# Altium schematic sheet MAX96724_EVB_revB.SchDoc
size C; SheetNumber: 1; SheetTotal: 4
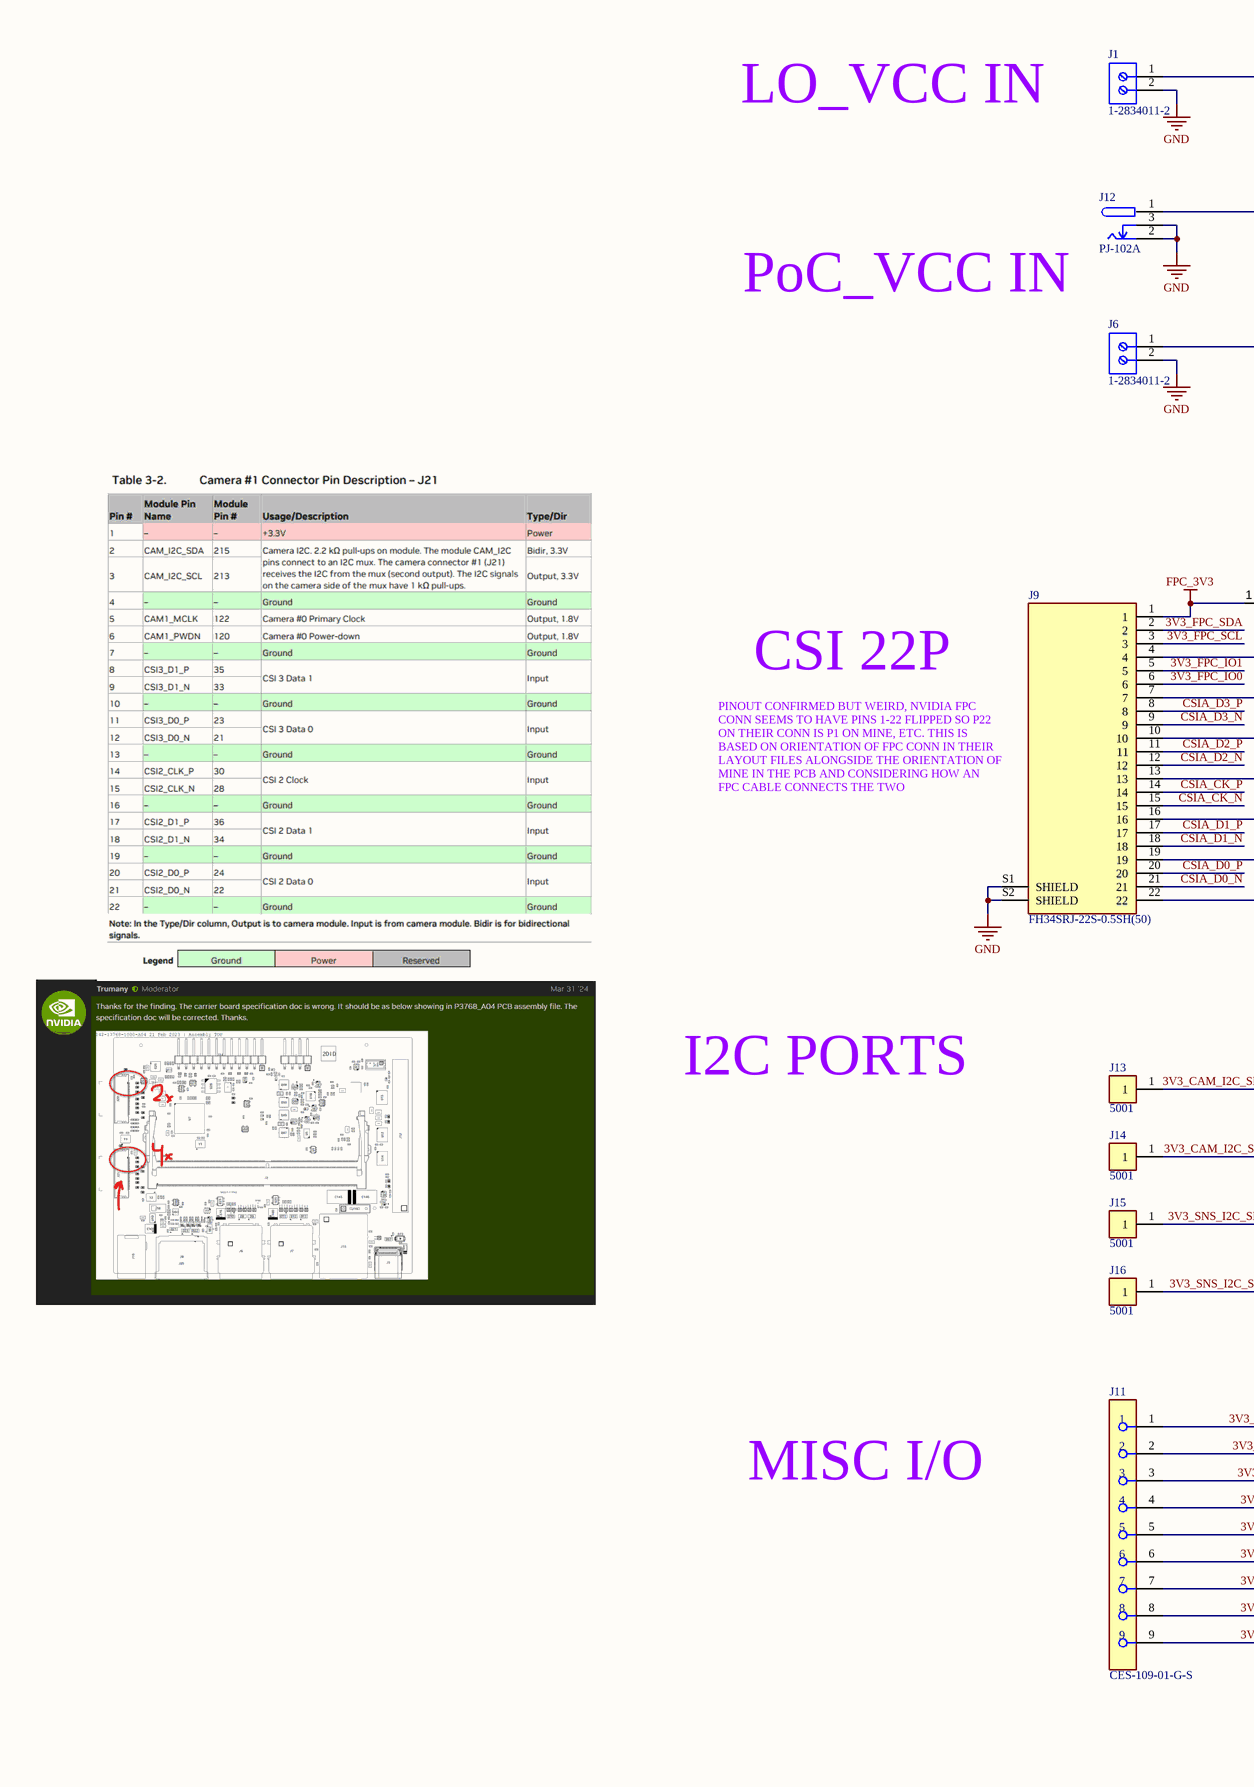
[diagram p0: MAX96724_EVB_revB.SchDoc, left]
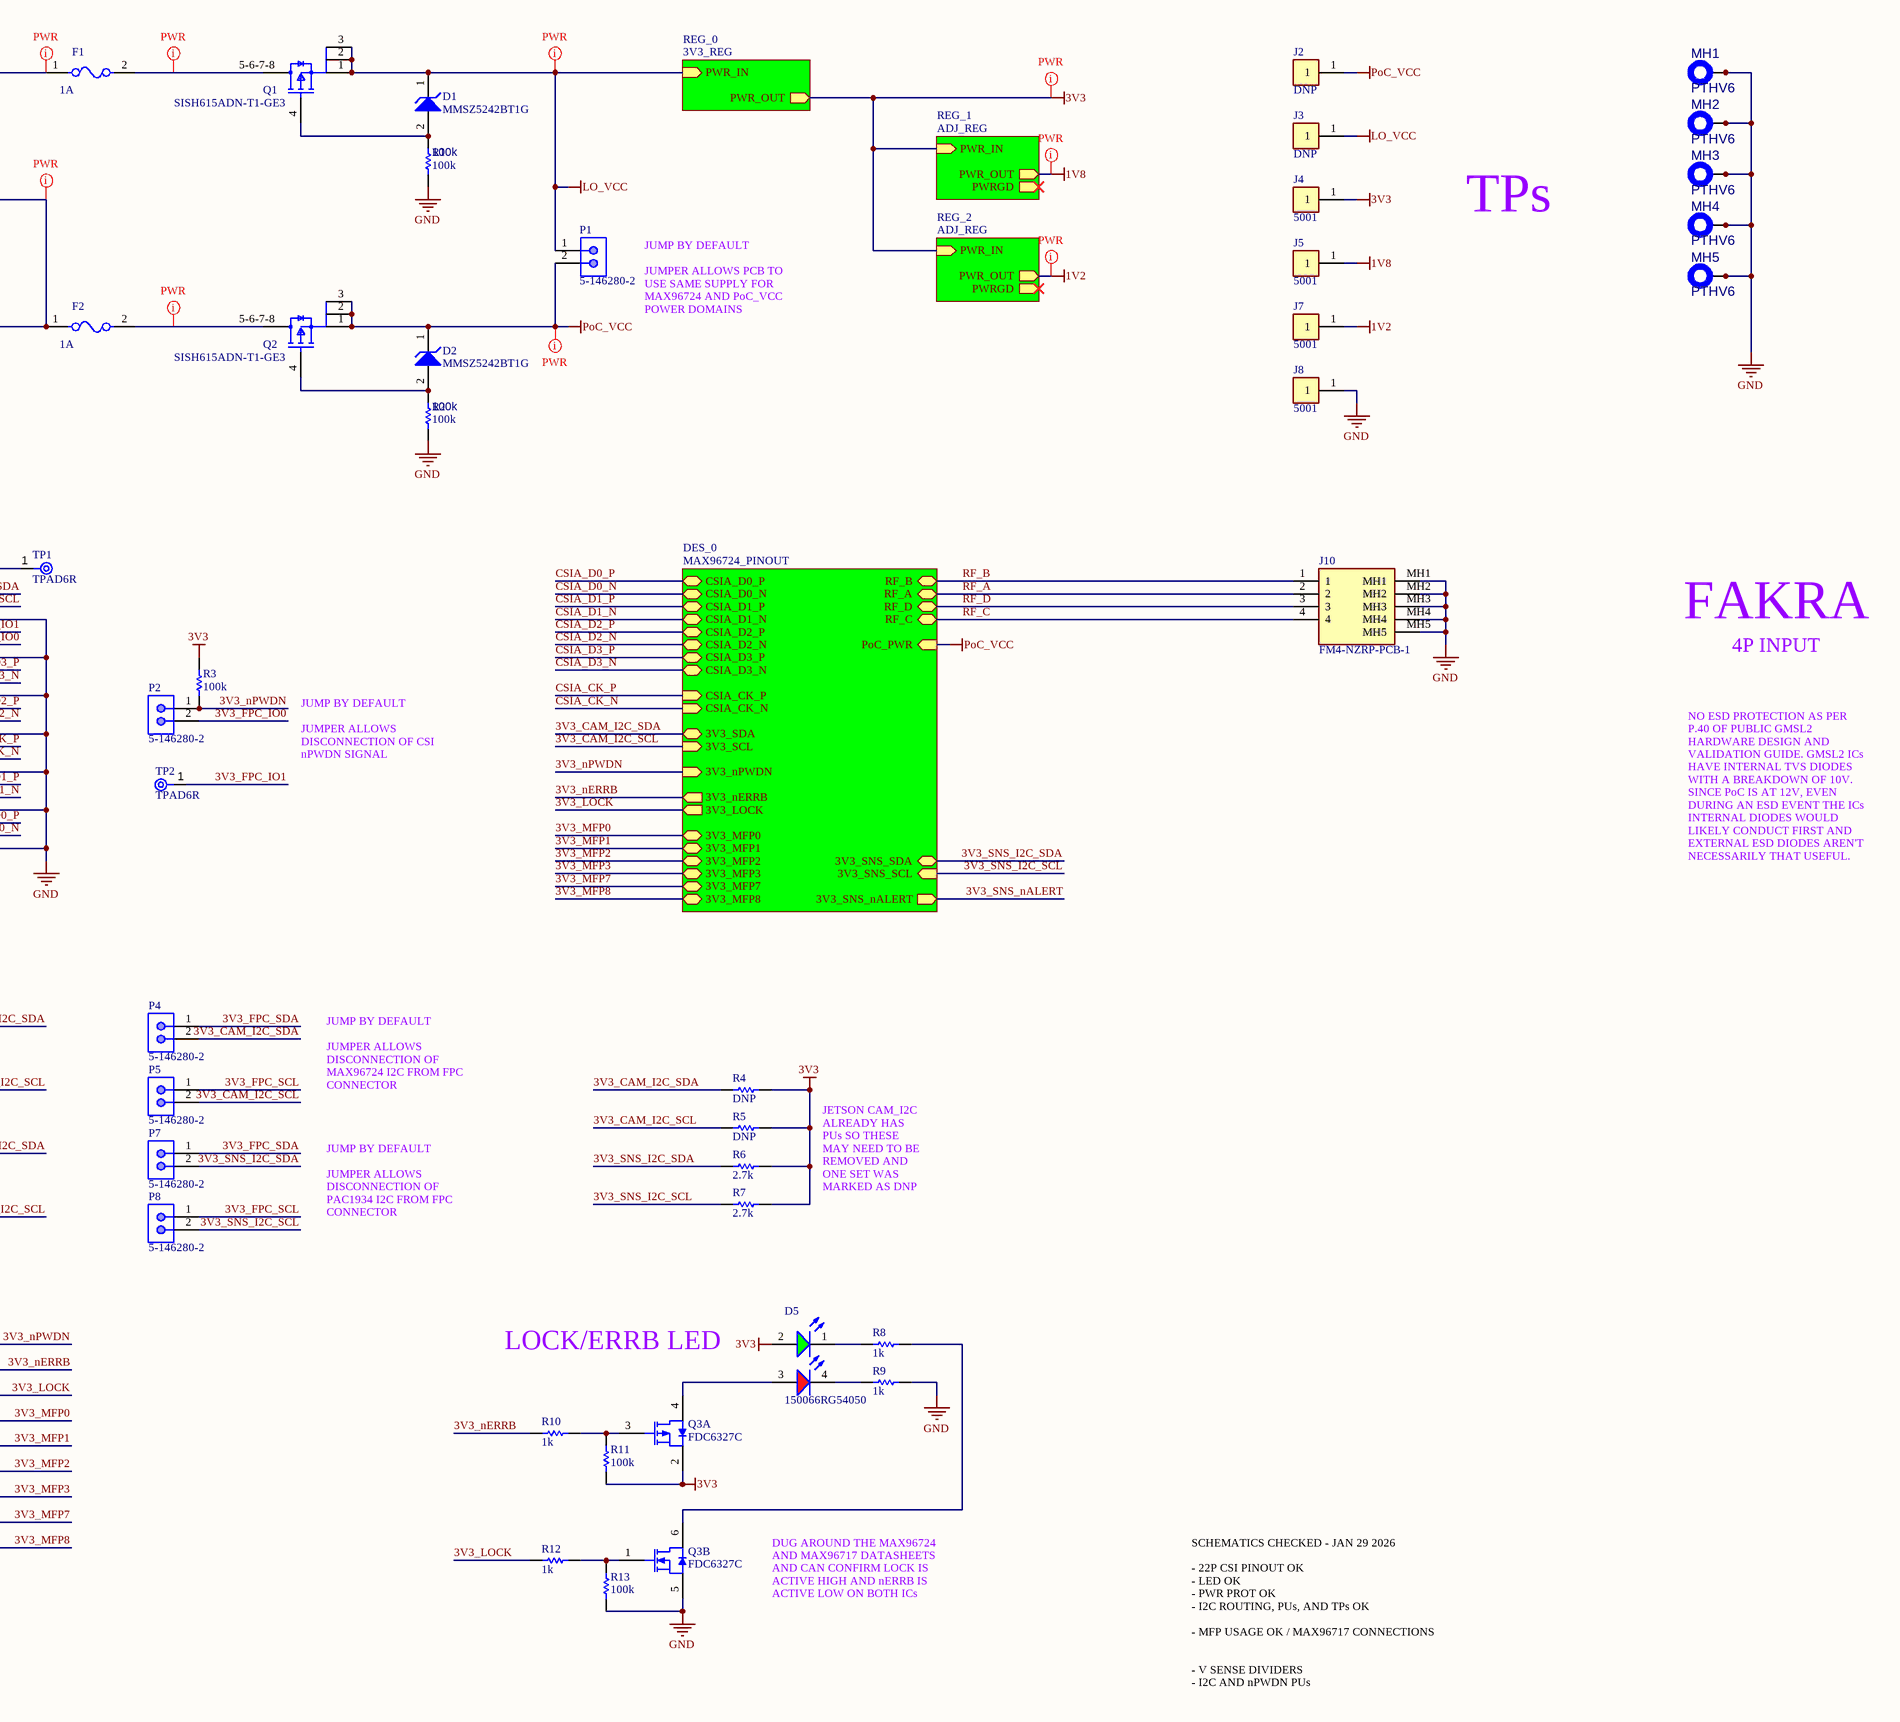
[diagram p1: MAX96724_EVB_revB.SchDoc, right]

## Parts
D1  MMSZ5242BT1G  [ONSC-SOD-123-2-425-04_V]
D2  MMSZ5242BT1G  [ONSC-SOD-123-2-425-04_V]
D5  150066RG54050  [WL-SBCD_0606]
F1  1A  [FP-SF-1206FP-MFG]
F2  1A  [FP-SF-1206FP-MFG]
J1  1-2834011-2  [1-2834011-2-Footprint-1]
J2  DNP  [FP-5001-MFG]
J3  DNP  [FP-5001-MFG]
J4  5001  [FP-5001-MFG]
J5  5001  [FP-5001-MFG]
J6  1-2834011-2  [1-2834011-2-Footprint-1]
J7  5001  [FP-5001-MFG]
J8  5001  [FP-5001-MFG]
J9  FH34SRJ-22S-0.5SH(50)  [FH34SRJ-22S-0.5SH(50)-Footprint-1]
J10  FM4-NZRP-PCB-1  [FM4-NZRP-PCB-1-Footprint-1]
J11  CES-109-01-G-S  [FP-CES-109-01-G-S-MFG]
J12  PJ-102A  [FP-PJ-102A-MFG]
J13  5001  [FP-5001-MFG]
J14  5001  [FP-5001-MFG]
J15  5001  [FP-5001-MFG]
J16  5001  [FP-5001-MFG]
MH1  PTHV6  [PTHV6 M2]  (net tie, no BOM)
MH2  PTHV6  [PTHV6 M2]  (net tie, no BOM)
MH3  PTHV6  [PTHV6 M2]  (net tie, no BOM)
MH4  PTHV6  [PTHV6 M2]  (net tie, no BOM)
MH5  PTHV6  [PTHV6 M2]  (net tie, no BOM)
P1  5-146280-2  [TECO-5-146280-2_V]
P2  5-146280-2  [TECO-5-146280-2_V]
P4  5-146280-2  [TECO-5-146280-2_V]
P5  5-146280-2  [TECO-5-146280-2_V]
P7  5-146280-2  [TECO-5-146280-2_V]
P8  5-146280-2  [TECO-5-146280-2_V]
Q1  SISH615ADN-T1-GE3  [SISH615ADN-T1-GE3-Footprint-1]
Q2  SISH615ADN-T1-GE3  [SISH615ADN-T1-GE3-Footprint-1]
Q3  FDC6327C  [FAIR-SOT23-6_V]  (parts A,B of 2)
R1  100k  [R0603B]
R2  100k  [R0603B]
R3  100k  [R0603B]
R4  DNP  [R0603B]
R5  DNP  [R0603B]
R6  2.7k  [R0603B]
R7  2.7k  [R0603B]
R8  1k  [R0603B]
R9  1k  [R0603B]
R10  1k  [R0603B]
R11  100k  [R0603B]
R12  1k  [R0603B]
R13  100k  [R0603B]
TP1  TPAD6R  [New footprint 1]  (no BOM)
TP2  TPAD6R  [New footprint 1]  (no BOM)

## Sub-sheets
DES_0 = MAX96724_PINOUT: PoC_PWR (in), RF_B (bidir), RF_A (bidir), RF_C (bidir), RF_D (bidir), 3V3_SDA (bidir), 3V3_SCL (in), 3V3_nPWDN (in), 3V3_nERRB (out), 3V3_LOCK (out), 3V3_MFP0 (bidir), 3V3_MFP1 (bidir), 3V3_MFP2 (bidir), 3V3_MFP3 (bidir), 3V3_MFP7 (bidir), 3V3_MFP8 (bidir), 3V3_SNS_SDA (bidir), 3V3_SNS_SCL (in), 3V3_SNS_nALERT (out), CSIA_D0_P (bidir), CSIA_D0_N (bidir), CSIA_D1_P (bidir), CSIA_D1_N (bidir), CSIA_D2_P (bidir), CSIA_D2_N (bidir), CSIA_D3_P (bidir), CSIA_D3_N (bidir), CSIA_CK_P (in), CSIA_CK_N (in)
REG_0 = 3V3_REG: PWR_IN (in), PWR_OUT (out)
REG_1 = ADJ_REG: PWR_OUT (out), PWR_IN (in), PWRGD (out)
REG_2 = ADJ_REG: PWR_OUT (out), PWR_IN (in), PWRGD (out)

## Nets
1V2: J7.1 ; sheet REG_2/PWR_OUT
1V8: J5.1 ; sheet REG_1/PWR_OUT
3V3: D5.2(A) J4.1 Q3.2(S) R3.2 R4.2 R5.2 R6.2 R7.2 R11.1 ; sheet REG_0/PWR_OUT, sheet REG_1/PWR_IN, sheet REG_2/PWR_IN
FPC_3V3: J9.1 TP1.1(TP)
GND: J1.2 J6.2 J8.1 J9.4 J9.7 J9.10 J9.13 J9.16 J9.19 J9.22 J9.S1(SHIELD) J9.S2(SHIELD) J10.MH1 J10.MH2 J10.MH3 J10.MH4 J10.MH5 J12.2 J12.3 MH1.1(MH) MH1.2(V1) MH1.3(V2) MH1.4(V3) MH1.5(V4) MH1.6(V5) MH1.7(V6) MH2.1(MH) MH2.2(V1) MH2.3(V2) MH2.4(V3) MH2.5(V4) MH2.6(V5) MH2.7(V6) MH3.1(MH) MH3.2(V1) MH3.3(V2) MH3.4(V3) MH3.5(V4) MH3.6(V5) MH3.7(V6) MH4.1(MH) MH4.2(V1) MH4.3(V2) MH4.4(V3) MH4.5(V4) MH4.6(V5) MH4.7(V6) MH5.1(MH) MH5.2(V1) MH5.3(V2) MH5.4(V3) MH5.5(V4) MH5.6(V5) MH5.7(V6) Q3.5(S) R1.1 R2.1 R9.1 R13.2
LO_VCC: D1.1(K) J3.1 P1.1 Q1.1(S) Q1.2(S) Q1.3(S) ; sheet REG_0/PWR_IN
PoC_VCC: D2.1(K) J2.1 P1.2 Q2.1(S) Q2.2(S) Q2.3(S) ; sheet DES_0/PoC_PWR
3V3_CAM_I2C_SCL: J14.1 P5.2 R5.1 ; sheet DES_0/3V3_SCL
3V3_CAM_I2C_SDA: J13.1 P4.2 R4.1 ; sheet DES_0/3V3_SDA
3V3_FPC_IO0: J9.6 P2.2
3V3_FPC_IO1: J9.5 TP2.1(TP)
3V3_FPC_SCL: J9.3 P5.1 P8.1
3V3_FPC_SDA: J9.2 P4.1 P7.1
3V3_LOCK: J11.3 R12.2 ; sheet DES_0/3V3_LOCK
3V3_MFP0: J11.4 ; sheet DES_0/3V3_MFP0
3V3_MFP1: J11.5 ; sheet DES_0/3V3_MFP1
3V3_MFP2: J11.6 ; sheet DES_0/3V3_MFP2
3V3_MFP3: J11.7 ; sheet DES_0/3V3_MFP3
3V3_MFP7: J11.8 ; sheet DES_0/3V3_MFP7
3V3_MFP8: J11.9 ; sheet DES_0/3V3_MFP8
3V3_nERRB: J11.2 R10.1 ; sheet DES_0/3V3_nERRB
3V3_nPWDN: J11.1 P2.1 R3.1 ; sheet DES_0/3V3_nPWDN
3V3_SNS_I2C_SCL: J16.1 P8.2 R7.1 ; sheet DES_0/3V3_SNS_SCL
3V3_SNS_I2C_SDA: J15.1 P7.2 R6.1 ; sheet DES_0/3V3_SNS_SDA
3V3_SNS_nALERT: sheet DES_0/3V3_SNS_nALERT
CSIA_CK_N: J9.15 ; sheet DES_0/CSIA_CK_N
CSIA_CK_P: J9.14 ; sheet DES_0/CSIA_CK_P
CSIA_D0_N: J9.21 ; sheet DES_0/CSIA_D0_N
CSIA_D0_P: J9.20 ; sheet DES_0/CSIA_D0_P
CSIA_D1_N: J9.18 ; sheet DES_0/CSIA_D1_N
CSIA_D1_P: J9.17 ; sheet DES_0/CSIA_D1_P
CSIA_D2_N: J9.12 ; sheet DES_0/CSIA_D2_N
CSIA_D2_P: J9.11 ; sheet DES_0/CSIA_D2_P
CSIA_D3_N: J9.9 ; sheet DES_0/CSIA_D3_N
CSIA_D3_P: J9.8 ; sheet DES_0/CSIA_D3_P
RF_A: J10.2 ; sheet DES_0/RF_A
RF_B: J10.1 ; sheet DES_0/RF_B
RF_C: J10.4 ; sheet DES_0/RF_C
RF_D: J10.3 ; sheet DES_0/RF_D
NetD1_2: D1.2(A) Q1.4(G) R1.2
NetD2_2: D2.2(A) Q2.4(G) R2.2
NetD5_1: D5.1(K) R8.2
NetD5_3: D5.3(A) Q3.4(D)
NetD5_4: D5.4(K) R9.2
NetF1_1: F1.1 J1.1
NetF1_2: F1.2 Q1.5-6-7-8(D)
NetF2_1: F2.1 J6.1 J12.1
NetF2_2: F2.2 Q2.5-6-7-8(D)
NetQ3_1: Q3.1(G) R12.1 R13.1
NetQ3_3: Q3.3(G) R10.2 R11.2
NetQ3_6: Q3.6(D) R8.1

## Layout directives
net class PWR: 1V2, 1V8, 3V3, LO_VCC, NetF1_1, NetF1_2, NetF2_1, NetF2_2, PoC_VCC

## Notes on the sheet
- LO_VCC IN
- TPs
- PoC_VCC IN
- JUMP BY DEFAULT
  JUMPER ALLOWS PCB TO USE SAME SUPPLY FOR MAX96724 AND PoC_VCC POWER DOMAINS
- CSI 22P
- FAKRA
- 4P INPUT
- (near J9) PINOUT CONFIRMED BUT WEIRD, NVIDIA FPC CONN SEEMS TO HAVE PINS 1-22 FLIPPED SO P22 ON THEIR CONN IS P1 ON MINE, ETC. THIS IS BASED ON ORIENTATION OF FPC CONN IN THEIR LAYOUT FILES ALONGSIDE THE ORIENTATION OF MINE IN THE PCB AND CONSIDERING HOW AN FPC CABLE CONNECTS THE TWO
- JUMP BY DEFAULT
  JUMPER ALLOWS DISCONNECTION OF CSI nPWDN SIGNAL
- NO ESD PROTECTION AS PER P.40 OF PUBLIC GMSL2 HARDWARE DESIGN AND VALIDATION GUIDE. GMSL2 ICs HAVE INTERNAL TVS DIODES WITH A BREAKDOWN OF 10V. SINCE PoC IS AT 12V, EVEN DURING AN ESD EVENT THE ICs INTERNAL DIODES WOULD LIKELY CONDUCT FIRST AND EXTERNAL ESD DIODES AREN'T NECESSARILY THAT USEFUL.
- I2C PORTS
- JUMP BY DEFAULT
  JUMPER ALLOWS DISCONNECTION OF MAX96724 I2C FROM FPC CONNECTOR
- JUMP BY DEFAULT
  JUMPER ALLOWS DISCONNECTION OF PAC1934 I2C FROM FPC CONNECTOR
- JETSON CAM_I2C ALREADY HAS PUs SO THESE MAY NEED TO BE REMOVED AND ONE SET WAS MARKED AS DNP
- LOCK/ERRB LED
- MISC I/O
- DUG AROUND THE MAX96724 AND MAX96717 DATASHEETS AND CAN CONFIRM LOCK IS ACTIVE HIGH AND nERRB IS ACTIVE LOW ON BOTH ICs
- SCHEMATICS CHECKED - JAN 29 2026
  - 22P CSI PINOUT OK
  - LED OK
  - PWR PROT OK
  - I2C ROUTING, PUs, AND TPs OK
  - MFP USAGE OK / MAX96717 CONNECTIONS
  - V SENSE DIVIDERS
  - I2C AND nPWDN PUs

## Library data of the parts
D1 D2 = CMP-1060-00565-1: Zener Voltage Regulator, 500 mW, 2-Pin SOD-123, Pb-Free, Tape and Reel; Manufacturer: On Semiconductor; P Max (W): 0.5; VZ Typ (V): 12; PartNumber: MMSZ5242BT1G; PackageReference: SOD-123-2-425-04; ComponentLink3URL: http://www.onsemi.com/pub_link/Collateral/425-04.PDF; Mounting Technology: Surface Mount; ComponentLink2Description: Datasheet; ComponentLink1URL: http://www.onsemi.com/; ComponentLink3Description: Package Specification; PackageDescription: 2-Pin SOD, Body 1.6 x 2.69 mm; PackageVersion: Rev. G, 10/2009; ComponentLink1Description: Manufacturer URL; RoHS: Pb-Free; ComponentLink2URL: http://www.onsemi.com/pub_link/Collateral/MMSZ5221BT1-D.PDF; Packing: Tape and Reel; DatasheetVersion: Rev. 12
D5 = CMP-004-00040-2: Led, Red/Grn, 180Mcd/230Mcd, 624Nm/525Nm Rohs Compliant: Yes; Source: rgled.SchLib; Component Type: Standard; Design Item ID: CMP-004-00034-2; Pins: 4
F1 F2 = CMP-07399-000013-1: FUSE BOARD MOUNT 2A 63VDC 1206; Voltage Rating (DC): 63V; Fuse Type: Board Mount (Cartridge Style Excluded); Approvals: UL; Mount: Surface Mount; Min Operating Temperature: -20°C; Max Operating Temperature: 105°C; Case Code (Imperial): 1206; Packaging: Cut Tape; Current Rating: 2A; RoHS Compliant: Yes; Series: SinglFuse™ SF-1206FP; Case Code (Metric): 3216; Case/Package: 1206
J1 J6 = CMP-002-00067-1: Barrier Strip Terminal Block; RoHS Compliant: Yes
J2-J5 J7 J8 J13-J16 = CMP-2000-05181-2: PC TEST POINT MINIATURE BLACK; Body Material: Bronze; Plating: Silver; Inside Diameter: 1.27mm; Hole Diameter: 1.6mm; Number of Ports: 1; Outside Diameter: 2.54mm; Insulation: Insulated; Insulation Material: Nylon; Mount: Through Hole; RoHS Compliant: Yes; Series: THM; Height: 0.3inch; Termination: Through Hole; Material: Nylon; Packaging: Bulk; Contact Material: Bronze; REACH SVHC: No SVHC; Contact Plating: Silver; Orientation: Straight; Lead Free: Lead Free; Package Quantity: 100; Length: 7.62mm; Flammability Rating: UL94 V-0; Number of Contacts: 1; Diameter: 2.54mm; Housing Color: Black; Color: Black
J9 = CMP-002-00104-1: 0.5Mm Pitch, 1.0Mm Height, Top And Bottom Contact, Back-Flip; Connector Type: Receptacle; Pins: 22; Min Operating Temperature: -55°C; Max Operating Temperature: 105°C; Mounting Technology: Surface Mount
J10 = CMP-002-00044-4: Connector RF Mini-FAKRA Plug 9GHz 50Ohm Solder Right Angle Through Hole; Source: fakra4ch.SchLib; Component Type: Standard; Pins: 9; Design Item ID: CMP-002-00085-1
J11 = CMP-00575-09340057-1: CES-109-01-G-S Conn Socket Strip SKT 9 POS 2.54mm Solder ST Top Entry Thru-Hole Tube; Manufacturer Lifecycle Status: PRODUCTION; Current Rating: 5.5A; Max Current Rating: 1A; Number of Contacts: 9; Max Voltage Rating (AC): 333V; Voltage Rating: 400V; Gender: Receptacle; Contact Resistance: 10mΩ; Depth: 3.05mm; NexarPartId: 9340057; Contact Plating: Gold; Termination: Solder; Housing Color: Black; REACH SVHC: No SVHC; Contact Material: Bronze, Gold, Nickel; Min Operating Temperature: -55°C; Radiation Hardening: No; Orientation: Straight; Length: 22.86mm; RoHS: Compliant; Housing Material: Polyester; Lifecycle Status: Production; Max Operating Temperature: 125°C; Pitch: 2.54mm; Height: 5.21mm; Number of Rows: 1
J12 = CMP-12637-106234071-1: PJ-102A 2.0 x 6.5 mm, 2.5 A, Horizontal, Through Hole, Tapered Pins, Dc Power Jack Connector; Voltage Rating (DC): 24V; Number of Contacts: 3; Outside Diameter: 6.5mm; Gender: Male; Shielding: No; Insulation Resistance: 50MΩ; Current Rating: 2.5A; Inside Diameter: 2mm; Number of Conductors: 2; Housing Color: Black; RoHS: Compliant; Diameter: 2.1mm; Mount: Through Hole; Contact Plating: Nickel; NexarPartId: 106234071; Voltage Rating: 24V; Housing Material: Thermoplastic; Max Operating Temperature: 85°C; Color: Black; Contact Material: Copper, Nickel, Tin; Orientation: Horizontal; Packaging: Bulk; Flammability Rating: UL94 V-0; Schedule B: 8536695050, 8536695050; Contact Gender: Male; Lead Free: Lead Free; Termination: Through Hole; Min Operating Temperature: -25°C; Height: 11.2mm; Lifecycle Status: Production
MH1-MH5 = CMP-00028-00001-13: Plated mounting hole with 6 peripheral vias. This is a generic symbol that groups all relevant footprints.
P1 P2 P4 P5 P7 P8 = CMP-2000-07492-1: Male Header, Pitch 2.54 mm, 1 x 2 Position, Height 8.21 mm, Tail Length 3.05 mm, -65 to 105 degC, RoHS, Bulk; Manufacturer: TE Connectivity; Mating Connector Lock: No(Without); Number of Positions: 2; Pitch: 2.54mm; PCB Mounting Orientation: Vertical; Keyed: No; Case\/Package: 100; Mating Post Length: 0.23inch; High Temperature Housing: Yes; Max Current Rating: 5A; PCB Thickness: 0.063inch; PCB Mount Retention: Without; Approvals: CSA; Current Rating: 3A; Radiation Hardening: No; Length: 4.67mm; Contact Mating Length: 0.23inch; Connector Type: Header; Number of Rows: 1; Termination Post Length: 0.12inch; Board Standoff: No(Without); Max Operating Temperature: 105degC; Contact Shape: Square; Selectively Loaded: No(Without); Gasket: No(Without); Number of Contacts: 2; Contact Gender: Male; Mating Alignment: No(Without); Manufacturer URL: http://www.te.com/; Datasheet URL: http://www.te.com/commerce/DocumentDelivery/DDEController?Action=showdoc&DocId=Customer+Drawing%7F146280%7FH1%7Fpdf%7FEnglish%7FENG_CD_146280_H1.pdf%7F5-146280-2; Mount: ThroughHole; Orientation: Straight; Packaging: Carton; Package Reference: 5-146280-2; Package Quantity: 500; Stabilizers: No(Without); Row Spacing: 2.54mm; Contact Material: CopperAlloy; Panel Mount Retention: No(Without); Datasheet Version: Rev. H1, 08/2016; Housing Colour: Black; Colour: Black; Package Description: Male Header, Pitch 2.54 mm, 1 x 2 Position, Height 8.21 mm, Tail Length 3.05 mm; Contact Plating: Matte; Housing Material: Polymer; Contact Protection: No(Without); Min Operating Temperature: -65degC; Mounting Technology: ThroughHole; Flammability Rating: UL94V-0; RoHSCompliant: true; Termination: ThroughHole; Depth: 2.34mm; High Speed Serial Data Connector: No
Q1 Q2 = CMP-013-00018-2: Trans MOSFET P-CH 20V 22.1A 8-Pin PowerPAK 1212 EP T/R; Source: SISH615ADN-T1-GE3.SchLib; Design Item ID: CMP-013-00036-4; Component Type: Standard; Pins: 5
Q3 = CMP-2000-04939-1: Dual N & P-Channel 2.5 V Specified PowerTrench(TM) MOSFET, -55 to 150 degC, 6-Pin SOT-23, RoHS, Tape and Reel; Manufacturer: Fairchild; Typical Rise Time: 9@NChannel; Rad Hard: No; Maximum Drain Source Voltage: 20V; Typical Fall Time: 3@NChannel; Typical Turn-On Delay Time: 5@NChannel; Maximum Continuous Drain Current: 2.7@NChannel; Typical Turn-Off Delay Time: 12@NChannel; RDS-on: 80@4.5V@NChannel; Channel Mode: Enhancement; Maximum Gate Source Voltage: ±8V; Package Version: Rev. 5, 05/2015; Operating Temperature: -55to150degC; Packaging: Tape&Reel; Package Reference: SOT23-6; Package URL: https://www.fairchildsemi.com/package-drawings/MA/MA06A.pdf; Package Description: 6-Pin Small Outline Transistor, Body 2.9 x 1.6 mm, Pitch 0.95 mm; Manufacturer URL: https://www.fairchildsemi.com/; Channel Type: N; Datasheet Version: Rev. E, 07/2000; Package: 6SuperSOT; Datasheet URL: https://www.fairchildsemi.com/datasheets/FD/FDC6327C.pdf; Mounting: SurfaceMount; Category: MOSFET
R1-R13 = CMP-009-00002-14: Resistor
  R1 R2: Value: 100k
TP1 TP2 = CMP-00025-3: Test Point .6mm